# EAGLE design gecko (EAGLE 7.4.0)
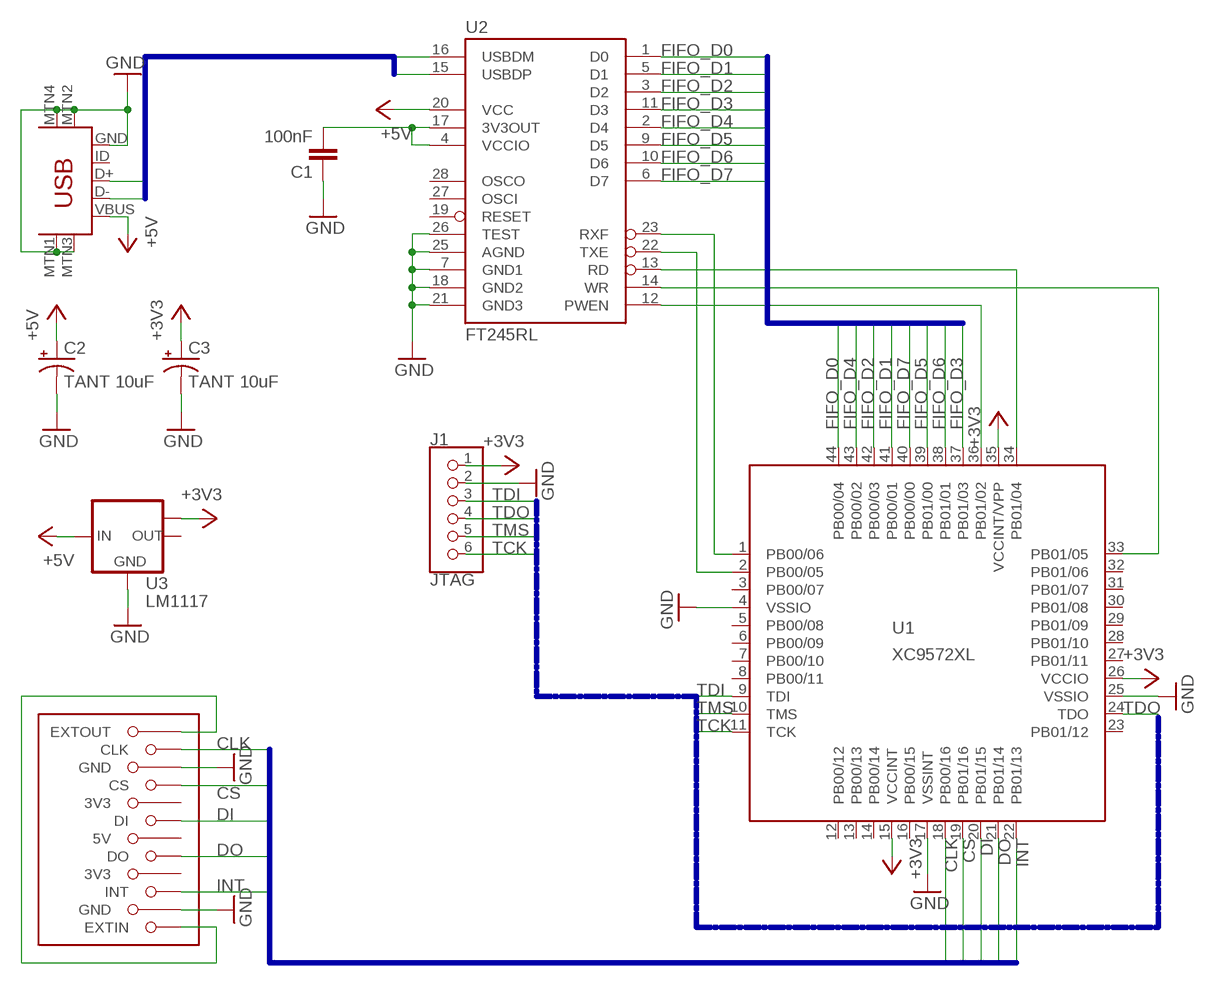
[diagram p0: schematic, sheet 1]

## Parts
C1  100nF  C-EUC0603  [C0603]
C2  TANT 10uF  CAP_POL1206-KIT  [EIA3216-KIT]
C3  TANT 10uF  CAP_POL1206-KIT  [EIA3216-KIT]
J1  JTAG  WIRE_6  [WIRE_6]
J2  USB-MINIB-5PIN  [USB-MINIB]
J3  GC_MEMCARD  [GC_MEMCARD]
U1  XC9572XL  XC9536_44VQ  [SQFP-S-10X10-44]
U2  FT245RL  [SSOP28DB]
U3  LM1117  LM1117MPX-3.3  [SOT223]

## Nets
+3V3: C3.A(+) J1.1 U1.15(VCCINT) U1.26(VCCIO) U1.35(VCCINT/VPP) U3.TAB(OUT1)
+5V: C2.A(+) J2.VBUS U2.20(VCC) U3.3(IN)
CLK: J3.11(CLK) U1.18(PB00/16)
CS: J3.9(CS) U1.19(PB01/16)
DI: J3.7(DI) U1.20(PB01/15)
DO: J3.5(DO) U1.21(PB01/14)
FIFO_D0: U1.44(PB00/04) U2.1(D0)
FIFO_D1: U1.41(PB00/01) U2.5(D1)
FIFO_D2: U1.42(PB00/03) U2.3(D2)
FIFO_D3: U1.37(PB01/03) U2.11(D3)
FIFO_D4: U1.43(PB00/02) U2.2(D4)
FIFO_D5: U1.39(PB01/00) U2.9(D5)
FIFO_D6: U1.38(PB01/01) U2.10(D6)
FIFO_D7: U1.40(PB00/00) U2.6(D7)
GND: C1.1 C2.C(-) C3.C(-) J1.2 J2.GND J2.MTN1(MTN2) J2.MTN2(MTN3) J2.MTN3(MTN1) J2.MTN4 J3.2(GND) J3.10(GND) U1.4(VSSIO) U1.17(VSSINT) U1.25(VSSIO) U2.7(GND1) U2.18(GND2) U2.21(GND3) U2.25(AGND) U2.26(TEST) U3.1(GND)
INT: J3.3(INT) U1.22(PB01/13)
N$1: C1.2 U2.4(VCCIO) U2.17(3V3OUT)
N$2: U1.36(PB01/02) U2.12(PWEN)
N$3: U1.33(PB01/05) U2.14(WR)
N$4: U1.34(PB01/04) U2.13(RD)
N$5: U1.1(PB00/06) U2.23(RXF)
N$6: U1.2(PB00/05) U2.22(TXE)
N$7: J3.1(EXTIN) J3.12(EXTOUT)
TCK: J1.6 U1.11(TCK)
TDI: J1.3 U1.9(TDI)
TDO: J1.4 U1.24(TDO)
TMS: J1.5 U1.10(TMS)
USB_D+: J2.D+ U2.15(USBDP)
USB_D-: J2.D- U2.16(USBDM)
Unconnected: J2.ID J3.4(3V3) J3.6(5V) J3.8(3V3) U1.3(PB00/07) U1.5(PB00/08) U1.6(PB00/09) U1.7(PB00/10) U1.8(PB00/11) U1.12(PB00/12) U1.13(PB00/13) U1.14(PB00/14) U1.16(PB00/15) U1.23(PB01/12) U1.27(PB01/11) U1.28(PB01/10) U1.29(PB01/09) U1.30(PB01/08) U1.31(PB01/07) U1.32(PB01/06) U2.19(RESET) U2.27(OSCI) U2.28(OSCO) U3.2(OUT)

## Buses
USB_D+,USB_D-
FIFO_D[0..7]
TDI,TMS,TDO,TCK
CLK,CS,DI,DO,INT

## Library data of the parts
C1 = rcl:C-EU: CAPACITOR, European symbol
C2 C3 = SparkFun-Capacitors:CAP_POL: Capacitor Polarized These are standard SMD and PTH capacitors. Normally 10uF, 47uF, and 100uF in electrolytic and tantalum varieties. Always verify the external diameter of the through hole cap, it varies with capacity, voltage, and manufacturer. The EIA devices should be standard.
J1 = random:WIRE_6: A nice 6-wire pad array.
J2 = SparkFun-Connectors:USB-MINIB: Mini-USB "B" connector with 5th pin broken out. Created new symbol breaking out 5th "ID" pin in mini/micro USB connector spec. See: http://en.wikipedia.org/wiki/Mini_usb#Cables. Uses same footprint as 4-pin symbol. Also added pins to connect to mounting / shield pads if required (probably not generally needed as signals aren't shielded once they leave the connector).; PROD_ID: CONN-08193
J3 = gc:GC_MEMCARD
U1 = xilinx-xc9:XC9536_44VQ: xc9536_pc44 XC9500 In-System Programmable CPLD Family Auto generated by make-symbol-device-package-bsdl.ulp Rev. 34 Source: xc9536_vq44.bsd; MPN: XC9536-15VQG44C; OC_FARNELL: 1193227; OC_NEWARK: 98K3377
U2 = SparkFun-DigitalIC:FT245RL: USB FIFO Controller 4th Generation USB Controller (USB <-> Parallel) - FIFO. Spark Fun Electronics SKU : COM-00787
U3 = lm1117:LM1117MPX-*

## Board
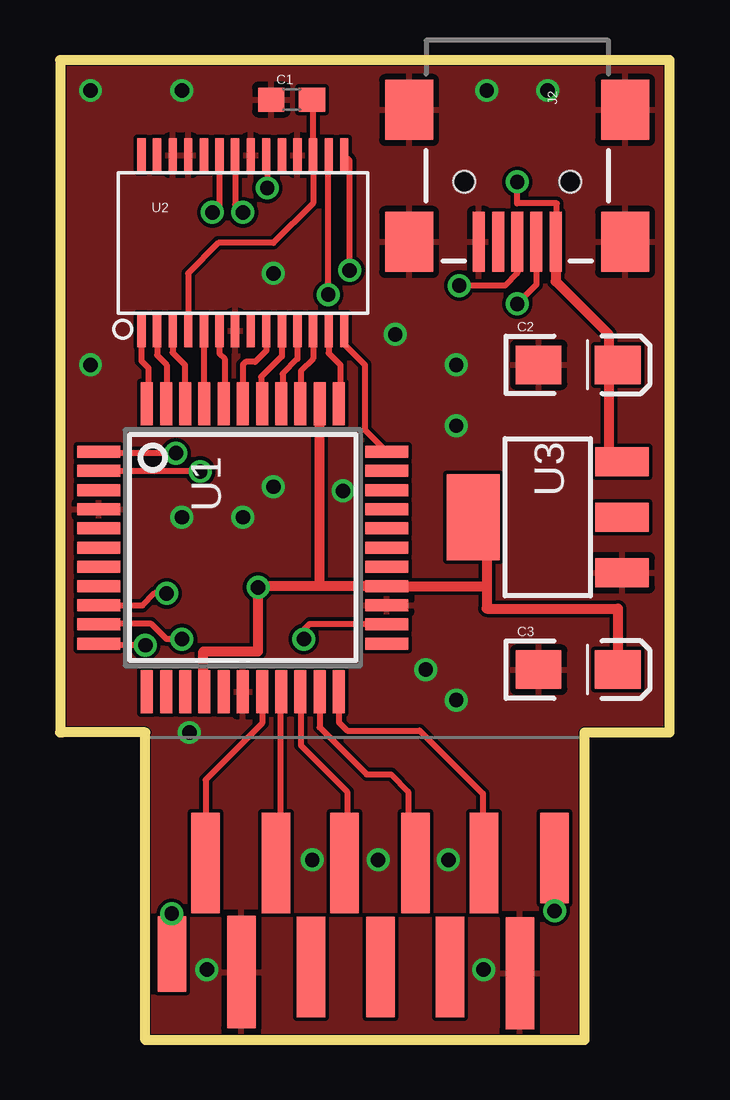
[diagram p1: board, top side]
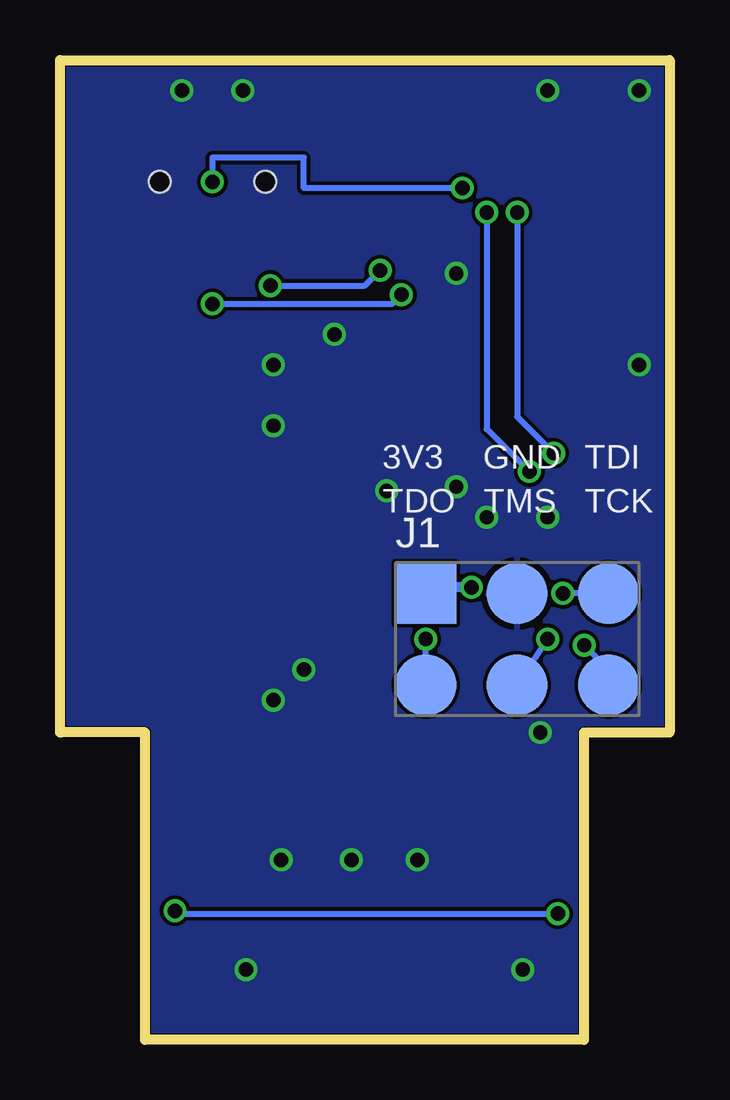
[diagram p2: board, bottom side, seen from below]

Size 25.4 x 40.83 mm. Coordinates in mm from the lower left corner, seen from the top.
Outline: 25.4,12.82 25.4,40.83 0,40.83 0,12.82
Outline: 25.33,12.81 21.86,12.81 21.86,0 3.56,0 3.56,12.81 0.08,12.81
Copper layers (1*16): Top 0.0356mm / dielectric 1.5011mm / Bottom 0.0356mm
Design rules "LaenPCBOrder *": minimum track width 6mil, minimum drill 13mil, track to track 6mil, track to pad 6mil, pad to pad 6mil, via to via 6mil, smd to smd 0mil, copper to edge 2mil, drill to drill 6mil, minimum pad ring 7mil, minimum via ring 7mil, stop-mask expansion 3mil, vias tented up to drill 9000mil, thermal gap 10mil

### Footprints (pad centres in the part's own frame; a part is rotated, then mirrored left to right if it is on the bottom)
C0603 = smd 1.1 x 1: 1 -0.85,0; 2 0.85,0
EIA3216-KIT = smd 1.9 x 1.6: A 1.65,0; C -1.65,0
WIRE_6 = smd 2.54 x 2.54: 1 -3.81,1.905; 2 0,1.905; 3 3.81,1.905; 4 -3.81,-1.905; 5 0,-1.905; 6 3.81,-1.905
USB-MINIB = smd 2.5 x 0.5: D+ 2.5,0; D- 2.5,0.8; GND 2.5,-1.6; ID 2.5,-0.8; VBUS 2.5,1.6 | smd 2.5 x 2: MTN1 -3,4.5; MTN2 2.5,4.5; MTN3 -3,-4.5; MTN4 2.5,-4.5 | hole 0.9: 0,2.2; 0,-2.2
GC_MEMCARD = smd 1.187 x 3.772: 1 17.05,7.58 | smd 1.187 x 4.68: 2 15.6,2.78; 10 4,2.83 | smd 1.187 x 4.191: 3 14.1,7.38; 4 12.7,3.03; 5 11.25,7.38; 6 9.8,3.03; 7 8.3,7.38; 8 6.9,3.03; 9 5.45,7.38; 11 2.5,7.38 | smd 1.187 x 3.143: 12 1.1,3.58
SQFP-S-10X10-44 = smd 0.5 x 1.8: 1 -4,-6; 2 -3.2,-6; 3 -2.4,-6; 4 -1.6,-6; 5 -0.8,-6; 6 0,-6; 7 0.8,-6; 8 1.6,-6; 9 2.4,-6; 10 3.2,-6; 11 4,-6; 23 4,6; 24 3.2,6; 25 2.4,6; 26 1.6,6; 27 0.8,6; 28 0,6; 29 -0.8,6; 30 -1.6,6; 31 -2.4,6; 32 -3.2,6; 33 -4,6 | smd 1.8 x 0.5: 12 6,-4; 13 6,-3.2; 14 6,-2.4; 15 6,-1.6; 16 6,-0.8; 17 6,0; 18 6,0.8; 19 6,1.6; 20 6,2.4; 21 6,3.2; 22 6,4; 34 -6,4; 35 -6,3.2; 36 -6,2.4; 37 -6,1.6; 38 -6,0.8; 39 -6,0; 40 -6,-0.8; 41 -6,-1.6; 42 -6,-2.4; 43 -6,-3.2; 44 -6,-4
SSOP28DB = smd 0.348 x 1.397: 1 -4.225,-3.656; 2 -3.575,-3.656; 3 -2.925,-3.656; 4 -2.275,-3.656; 5 -1.625,-3.656; 6 -0.975,-3.656; 7 -0.325,-3.656; 8 0.325,-3.656; 9 0.975,-3.656; 10 1.625,-3.656; 11 2.275,-3.656; 12 2.925,-3.656; 13 3.575,-3.656; 14 4.225,-3.656; 15 4.225,3.656; 16 3.575,3.656; 17 2.925,3.656; 18 2.275,3.656; 19 1.625,3.656; 20 0.975,3.656; 21 0.325,3.656; 22 -0.325,3.656; 23 -0.975,3.656; 24 -1.625,3.656; 25 -2.275,3.656; 26 -2.925,3.656; 27 -3.575,3.656; 28 -4.225,3.656
SOT223 = smd 1.219 x 2.235: 1 -2.311,-3.099; 2 0,-3.099; 3 2.311,-3.099 | smd 3.6 x 2.2: TAB 0,3.099

### Placement (x,y rotation side)
C1  9.65,39.18 0 top
C2  21.59,28.13 0 top
C3  21.59,15.43 0 top
J1  6.35,16.7 0 bottom
J2  19.05,35.75 270 top
J3  3.56,0 0 top
U1  7.62,20.51 270 top
U2  7.62,33.21 0 top
U3  20.32,21.78 90 top

### Tracks (layer width: path | path; a pad name or v marks a point on that pad's centre or on a via)
+3V3  (via drill 0.6)
  Top 0.406: U3.TAB 17.78,21.78 17.78,18.91 | 17.78,18.91 17.78,17.97 23.24,17.97 C3.A | 17.78,18.91 U1.26 10.79,18.91 | U1.35 10.79,26.51 10.79,18.91 | U1.15 5.97,14.51 5.97,16.19 8.25,16.19 v8.25,18.86 8.25,18.91 10.79,18.91
  Bottom 0.406: v8.25,18.86 10.16,18.86 J1.1
+5V  (via drill 0.6)
  Top 0.254: J2.VBUS 20.7,33.25 20.7,34.86 19.05,34.86 v19.05,35.75 | U2.20 8.64,36.87 v8.64,35.5
  Top 0.406: J2.VBUS 20.65,31.61 22.86,29.4 22.86,28.51 | 22.86,28.51 C2.A | U3.3 22.86,24.65 22.86,28.51
  Bottom 0.254: v8.64,35.5 15.24,35.5 15.24,36.77 19.05,36.77 v19.05,35.75
CLK
  Top 0.254: U1.18 8.42,13.19 6.07,10.84 J3.11
CS
  Top 0.254: U1.19 9.18,14.51 9.18,7.55 J3.9
DI
  Top 0.254: U1.20 10.03,14.5 10.03,12.29 11.97,10.35 11.97,7.49 J3.7
DO
  Top 0.254: U1.21 10.82,13.02 12.78,11.06 13.8,11.06 14.51,10.35 14.51,7.68 J3.5
FIFO_D0
  Top 0.254: U2.1 3.39,28.29 3.68,28 3.68,26.57 U1.44
FIFO_D1
  Top 0.254: U2.5 6,26.54 U1.41
FIFO_D2
  Top 0.254: U2.3 4.69,28.64 5.21,28.13 5.21,26.52 U1.42
FIFO_D3
  Top 0.254: U2.11 9.89,28.37 9.27,27.75 9.27,26.56 U1.37
FIFO_D4
  Top 0.254: U2.2 4.04,28.53 4.44,28.13 4.44,26.54 U1.43
FIFO_D5
  Top 0.254: U2.9 8.6,28.72 8.13,28.26 7.75,28.26 7.62,28.13 U1.39
FIFO_D6
  Top 0.254: U2.10 9.25,28.49 8.38,27.62 8.38,26.55 U1.38
FIFO_D7
  Top 0.254: U2.6 6.64,28.6 6.86,28.38 6.86,26.55 U1.40
GND  (via drill 0.6)
  other vias: 15.24,15.43 16.51,14.16 8.89,23.05 7.62,21.78 5.08,21.78 13.97,29.4 16.51,28.13 16.51,25.59 1.27,39.56 17.78,39.56 20.32,39.56 5.08,39.56 1.27,28.13 8.89,31.94 6.12,2.93 17.65,2.93 5.39,12.81 11.79,22.88 10.51,7.5 13.26,7.5 16.18,7.5
  pour Top: 3.56,0 21.86,0 21.86,12.81 25.33,12.81 25.33,40.81 0.08,40.81 0.08,12.81 3.56,12.81
  pour Bottom: 3.56,0 21.86,0 21.86,12.81 25.33,12.81 25.33,40.81 0.08,40.81 0.08,12.81 3.56,12.81
INT
  Top 0.254: U1.22 11.62,13.24 11.97,12.89 14.99,12.89 17.62,10.26 17.62,7.42 J3.3
N$1
  Top 0.254: C1.2 10.54,39.14 U2.17 10.54,34.86 8.89,33.21 6.6,33.21 5.33,31.94 5.33,29.57 U2.4
N$2
  Top 0.254: U2.12 10.54,28.39 10.03,27.88 10.03,26.52 U1.36
N$3
  Top 0.254: U2.14 11.85,28.99 12.7,28.13 12.7,25.43 U1.33
N$4
  Top 0.254: U2.13 11.19,28.62 11.68,28.13 11.68,26.57 U1.34
N$5  (via drill 0.6)
  Top 0.254: U2.23 6.64,34.78 v6.35,34.48 | v4.83,24.45 1.68,24.45 U1.1
  Bottom 0.254: v6.35,34.48 6.35,25.97 v4.83,24.45
N$6  (via drill 0.6)
  Top 0.254: U2.22 7.29,34.81 v7.62,34.48 | v5.84,23.68 1.64,23.68 U1.2
  Bottom 0.254: v7.62,34.48 7.62,25.46 v5.84,23.68
N$7  (via drill 0.6)
  Top 0.254: J3.1 v20.61,5.38 | v4.66,5.26 J3.12
  Bottom 0.254: v20.61,5.38 20.61,5.26 v4.66,5.26
TCK  (via drill 0.6)
  Top 0.254: v3.56,16.45 1.68,16.45 U1.11
  Bottom 0.254: J1.6 2.54,15.43 v3.56,16.45
TDI  (via drill 0.6)
  Top 0.254: v4.44,18.61 3.94,18.61 3.43,18.1 1.63,18.1 U1.9
  Bottom 0.254: J1.3 v4.44,18.61
TDO  (via drill 0.6)
  Top 0.254: v10.16,16.7 10.16,17.08 10.41,17.34 13.6,17.34 U1.24
  Bottom 0.254: J1.4 v10.16,16.7
TMS  (via drill 0.6)
  Top 0.254: v5.08,16.7 4.44,16.7 3.81,17.34 1.64,17.34 U1.10
  Bottom 0.254: J1.5 v5.08,16.7
USB_D+  (via drill 0.6)
  Top 0.254: J2.D+ 19.05,31.94 18.54,31.43 v16.64,31.43 | v12.07,32.07 12.07,36.65 U2.15
  Bottom 0.254: v16.64,31.43 12.7,31.43 v12.07,32.07
USB_D-  (via drill 0.6)
  Top 0.254: J2.D- 19.85,31.47 v19.05,30.67 | v11.18,31.05 11.18,36.85 U2.16
  Bottom 0.254: v19.05,30.67 11.56,30.67 v11.18,31.05

### Text on the board
bPlace: TDI | GND | 3V3 | TCK | TMS | TDO